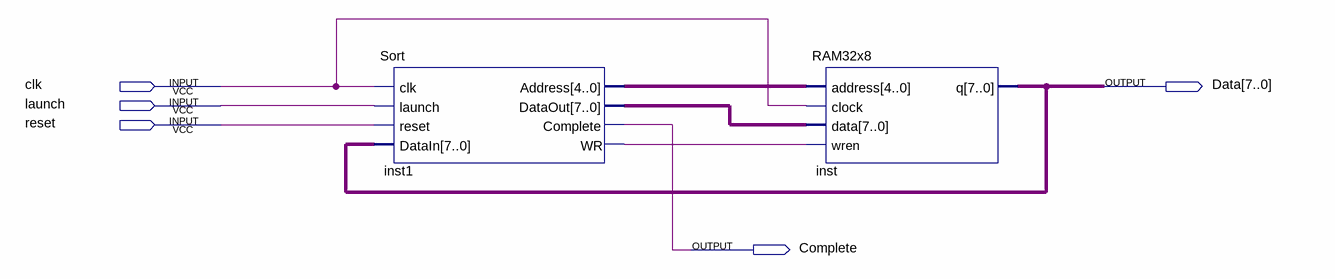
[diagram p0: schematic sheet]
// Quartus schematic Sorter.bdf as structural Verilog: 2 symbols, 5 pins
module Sorter (
  input  clk,
  input  launch,
  input  reset,
  output [7:0] Data,
  output Complete
);

  wire inst1_wr;
  wire [4:0] inst1_address;
  wire [7:0] inst1_dataout;

  Sort inst1 (
    .clk(clk), .launch(launch), .reset(reset), .DataIn(Data), .Address(inst1_address),
    .DataOut(inst1_dataout), .Complete(Complete), .WR(inst1_wr));
  RAM32x8 inst (.address(inst1_address), .clock(clk), .data(inst1_dataout), .wren(inst1_wr), .q(Data));
endmodule
